# Altium schematic sheet gateway.SchDoc
size A3
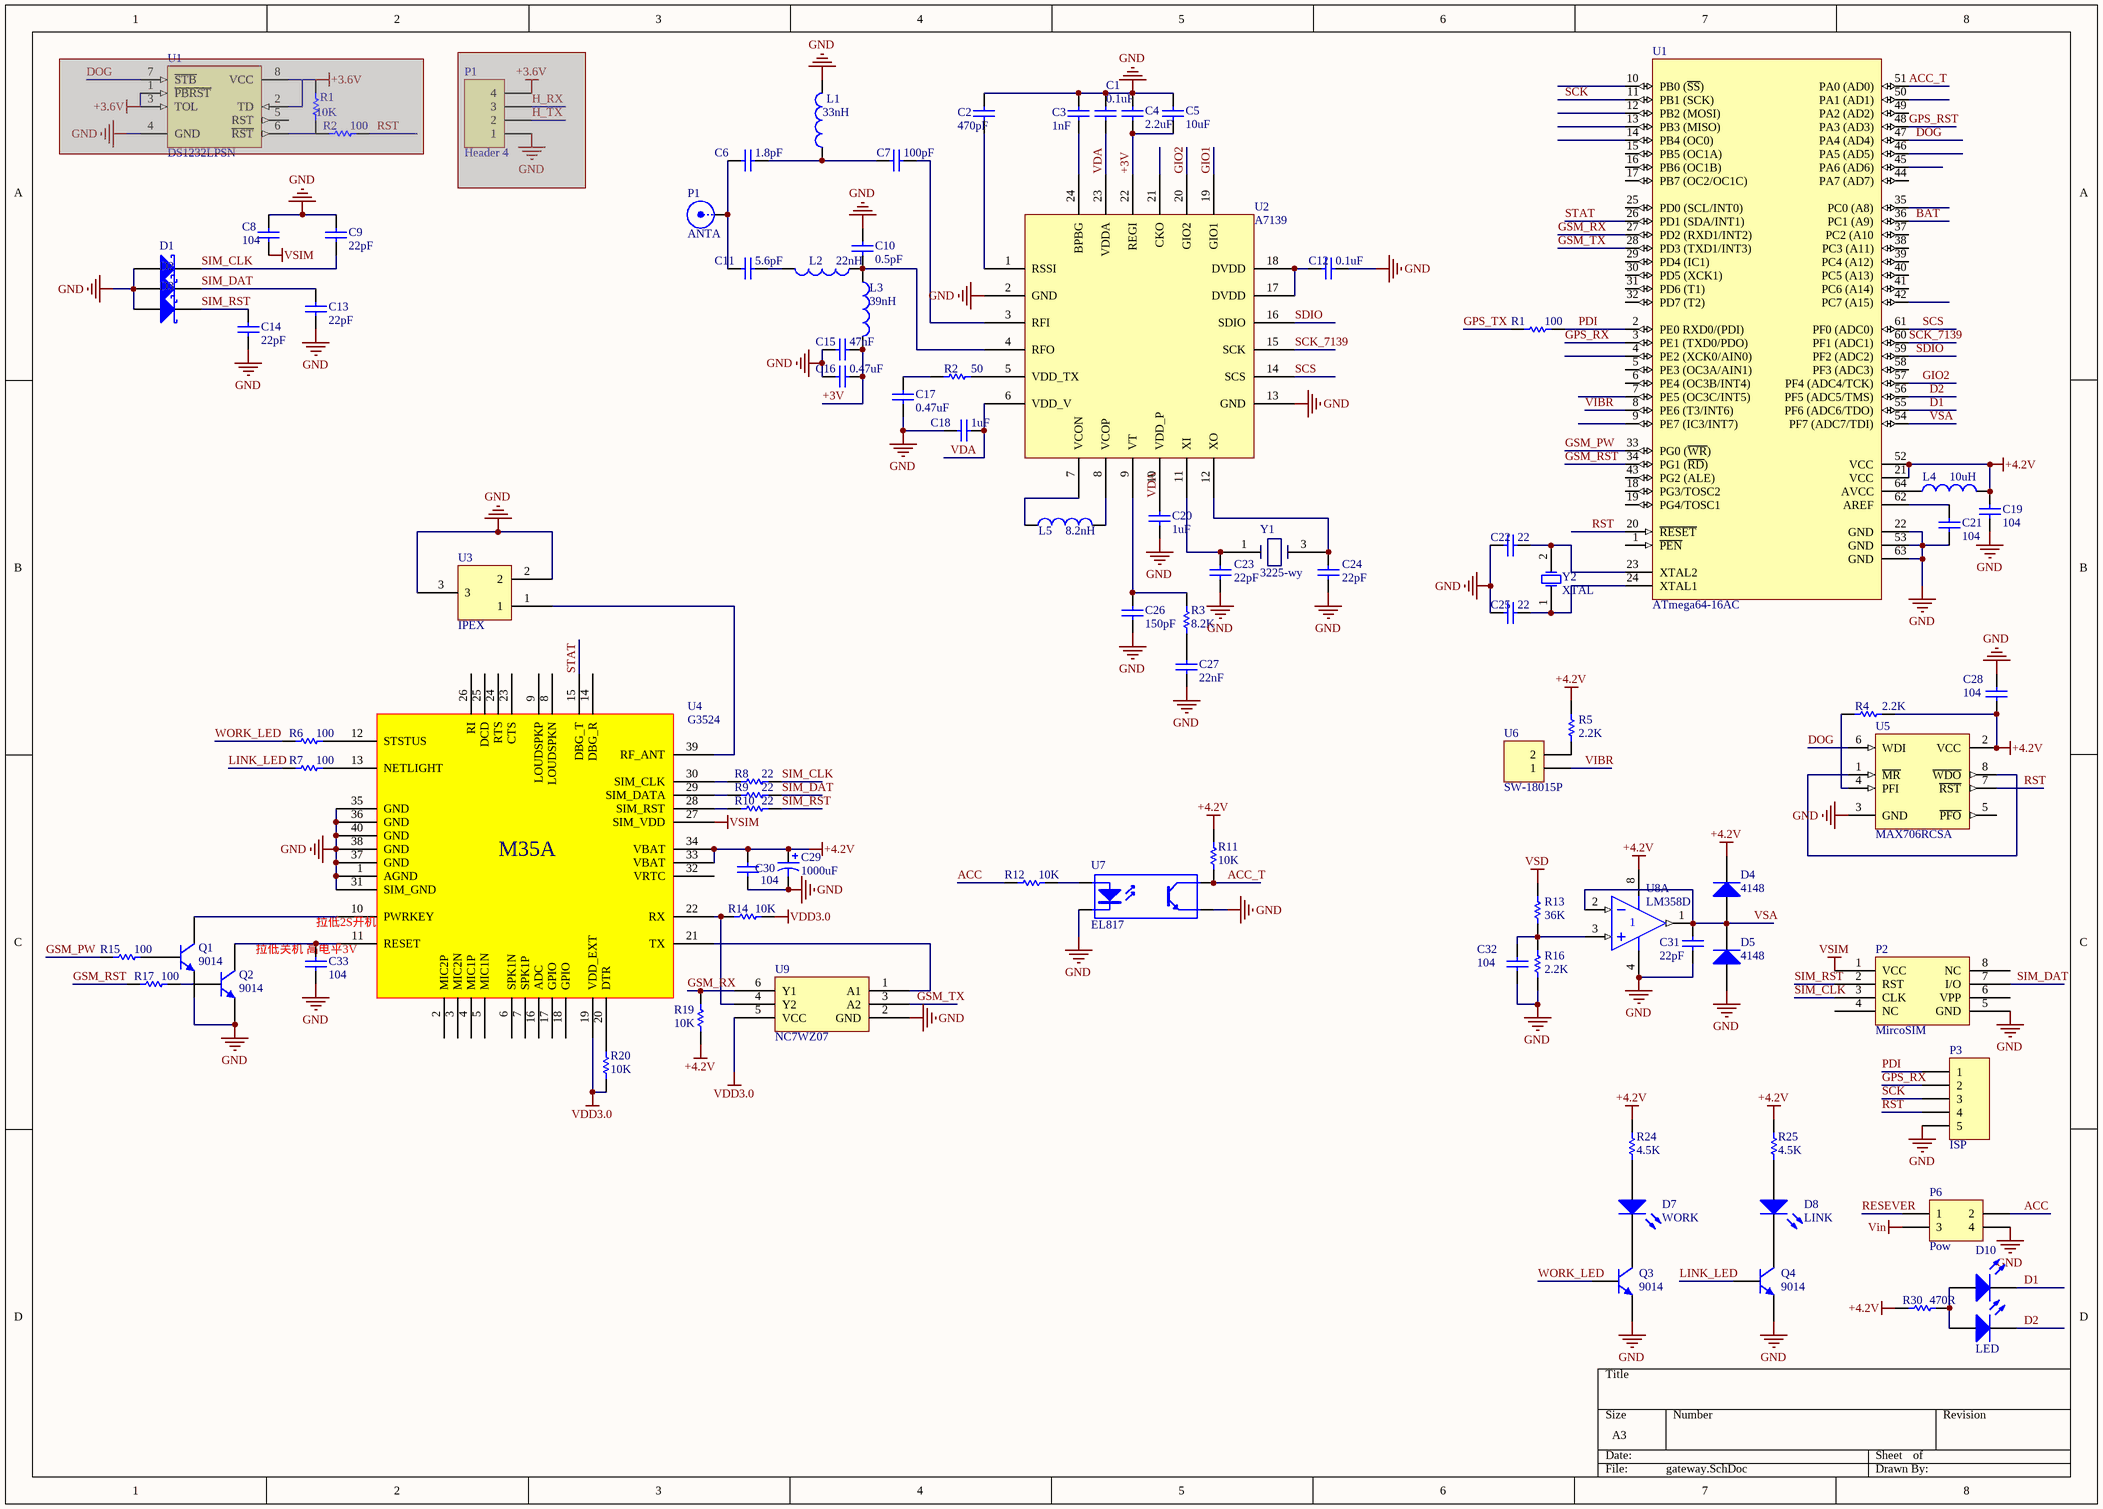
[diagram p0: gateway.SchDoc]

## Parts
(Parts that share a designator on the sheet are numbered #1, #2 ... from top to bottom, then left to right.)
C1  value 0.1uF  [0402-A]  (hidden comment: Cap)
C2  value 470pF  [0402-A]  (hidden comment: Cap)
C3  value 1nF  [0402-A]  (hidden comment: Cap)
C4  value 2.2uF  [0603]  (hidden comment: Cap)
C5  value 10uF  [0603]  (hidden comment: Cap)
C6  value 1.8pF  [0402-A]  (hidden comment: Cap)
C7  value 100pF  [0402-A]  (hidden comment: Cap)
C8  value 104  [0603]  (hidden comment: Cap)
C9  value 22pF  [0603]  (hidden comment: Cap)
C10  value 0.5pF  [0402-A]  (hidden comment: Cap)
C11  value 5.6pF  [0402-A]  (hidden comment: Cap)
C12  value 0.1uF  [0402-A]  (hidden comment: Cap)
C13  value 22pF  [0603]  (hidden comment: Cap)
C14  value 22pF  [0603]  (hidden comment: Cap)
C15  value 47nF  [0402-A]  (hidden comment: Cap)
C16  value 0.47uF  [0402-A]  (hidden comment: Cap)
C17  value 0.47uF  [0402-A]  (hidden comment: Cap)
C18  value 1uF  [0402-A]  (hidden comment: Cap)
C19  value 104  [0603]  (hidden comment: Cap)
C20  value 1uF  [0402-A]  (hidden comment: Cap)
C21  value 104  [0603]  (hidden comment: Cap)
C22  value 22  [0603]  (hidden comment: Cap)
C23  value 22pF  [0402-A]  (hidden comment: Cap)
C24  value 22pF  [0402-A]  (hidden comment: Cap)
C25  value 22  [0603]  (hidden comment: Cap)
C26  value 150pF  [0402-A]  (hidden comment: Cap)
C27  value 22nF  [0402-A]  (hidden comment: Cap)
C28  value 104  [0603]  (hidden comment: Cap)
C29  value 1000uF  [C8x10-SMD]  (hidden comment: Cap Pol3)
C30  value 104  [0603]  (hidden comment: Cap)
C31  value 22pF  [0603]  (hidden comment: Cap)
C32  value 104  [0603]  (hidden comment: Cap)
C33  value 104  [0603]  (hidden comment: Cap)
D1  RL0603E012M100K  [0603]  (value not drawn)
D2  RL0603E012M100K  [0603]  (value not drawn)
D3  RL0603E012M100K  [0603]  (value not drawn)
D4  4148  [LL34]
D5  4148  [LL34]
D7  WORK  [0603-LED]
D8  LINK  [0603-LED]
D10  LED  [DIP-3]
L1  value 33nH  [0603]  (hidden comment: Inductor)
L2  value 22nH  [0603]  (hidden comment: Inductor)
L3  value 39nH  [0603]  (hidden comment: Inductor)
L4  value 10uH  [0603]  (hidden comment: Inductor)
L5  value 8.2nH  [0402-A]  (hidden comment: Inductor)
P1#1  Header 4  [HDR1X4]  (masked out: inside a compile mask, not in the netlist)
P1#2  ANTA  [SMB_V-RJ45]
P2  MircoSIM  [Micro SIM]
P3  ISP  [HDR1X5]
P6  Pow  [5569]
Q1  value 9014  [SOT-23-NPN]  (hidden comment: NPN)
Q2  value 9014  [SOT-23-NPN]  (hidden comment: NPN)
Q3  value 9014  [SOT-23-NPN]  (hidden comment: NPN)
Q4  value 9014  [SOT-23-NPN]  (hidden comment: NPN)
R1#1  value 10K  [0603]  (hidden comment: Res1)  (masked out: inside a compile mask, not in the netlist)
R1#2  value 100  [0603]  (hidden comment: Res1)
R2#1  value 100  [0603]  (hidden comment: Res1)  (masked out: inside a compile mask, not in the netlist)
R2#2  value 50  [0402-A]  (hidden comment: Res1)
R3  value 8.2K  [0402-A]  (hidden comment: Res1)
R4  value 2.2K  [0603]  (hidden comment: Res1)
R5  value 2.2K  [0603]  (hidden comment: Res1)
R6  value 100  [0603]  (hidden comment: Res1)
R7  value 100  [0603]  (hidden comment: Res1)
R8  value 22  [0603]  (hidden comment: Res1)
R9  value 22  [0603]  (hidden comment: Res1)
R10  value 22  [0603]  (hidden comment: Res1)
R11  value 10K  [0603]  (hidden comment: Res1)
R12  value 10K  [0603]  (hidden comment: Res1)
R13  value 36K  [0603]  (hidden comment: Res1)
R14  value 10K  [0603]  (hidden comment: Res1)
R15  value 100  [0603]  (hidden comment: Res1)
R16  value 2.2K  [0603]  (hidden comment: Res1)
R17  value 100  [0603]  (hidden comment: Res1)
R19  value 10K  [0603]  (hidden comment: Res1)
R20  value 10K  [0603]  (hidden comment: Res1)
R24  value 4.5K  [0603]  (hidden comment: Res1)
R25  value 4.5K  [0603]  (hidden comment: Res1)
R30  value 470R  [0603]  (hidden comment: Res1)
U1#1  ATmega64-16AC  [64A_M]
U1#2  value DS1232LPSN  [SOIC8]  (hidden comment: DS1232)  (masked out: inside a compile mask, not in the netlist)
U2  A7139  [QFN24N]
U3  IPEX  [IPEX]
U4  G3524  [G3524]
U5  MAX706RCSA  [SOIC8]
U6  SW-18015P  [SW-18015]
U7  EL817  [PCBComponent_1]
U8  LM358D  [SOIC8]  (part A of 2)
U9  NC7WZ07  [SC70-6]
Y1  3225-wy
Y2  XTAL  [49SD]

## Nets
+4.2V: C19.1 C28.2 C29.1 C30.2 D4.2(K) L4.2 R4.2 R5.2 R11.2 R19.2 R24.1 R25.1 R30.2 U1#1.21(VCC) U1#1.52(VCC) U4.33(VBAT) U4.34(VBAT) U5.2(VCC) U8.8(V+)
GND: C1.2 C2.2 C3.2 C4.2 C5.2 C8.1 C9.1 C10.2 C12.2 C13.2 C14.2 C15.1 C16.1 C17.1 C18.2 C19.2 C20.1 C21.2 C22.2 C23.1 C24.1 C25.2 C26.1 C27.2 C28.1 C29.2 C30.1 C31.1 C32.2 C33.2 D1.2(A) D2.2(A) D3.2(A) D5.1(A) L1.2 P1#2.2(Y) P2.5(GND) P3.5 P6.4 Q1.1(E) Q2.1(E) Q3.1(E) Q4.1(E) R16.1 U1#1.22(GND) U1#1.53(GND) U1#1.63(GND) U2.2(GND) U2.13(GND) U2.25(GND) U3.2 U3.3 U4.1(AGND) U4.31(SIM_GND) U4.35(GND) U4.36(GND) U4.37(GND) U4.38(GND) U4.40(GND) U5.3(GND) U7.2(K) U7.3(E) U8.4(V-) U9.2(GND)
VDD3.0: R14.1 R20.2 U4.19(VDD_EXT) U9.5(VCC)
Vin: P6.3
VSD: R13.2
VSIM: C8.2 P2.1(VCC) U4.27(SIM_VDD)
+3V: C4.1 C5.1 C15.2 C16.2 L3.2 U2.22(REGI)
ACC: P6.2 R12.1
ACC_T: R11.1 U1#1.51(PA0_(AD0)) U7.4(C)
BAT: U1#1.36(PC1_(A9))
D1: D10.1(K) U1#1.55(PF6_(ADC6/TDO))
D2: D10.3(K) U1#1.56(PF5_(ADC5/TMS))
DOG: U1#1.47(PA4_(AD4)) U5.6(WDI)
GIO1: U2.19(GIO1)
GIO2: U1#1.57(PF4_(ADC4/TCK)) U2.20(GIO2)
GPS_RST: U1#1.48(PA3_(AD3))
GPS_RX: P3.2 U1#1.3(PE1_(TXD0/PDO))
GPS_TX: R1#2.1
GSM_PW: R15.2 U1#1.33(PG0_(~{WR}))
GSM_RST: R17.2 U1#1.34(PG1_(~{RD}))
GSM_RX: R19.1 U1#1.27(PD2_(RXD1/INT2)) U9.6(Y1)
GSM_TX: U1#1.28(PD3_(TXD1/INT3)) U9.3(A2)
LINK_LED: Q4.2(B) R7.2
PDI: P3.1 R1#2.2 U1#1.2(PE0_RXD0/(PDI))
RESEVER: P6.1
RST: P3.4 U1#1.20(~{RESET}) U5.7(~{RST})
SCK: P3.3 U1#1.11(PB1_(SCK))
SCK_7139: U1#1.60(PF1_(ADC1)) U2.15(SCK)
SCS: U1#1.61(PF0_(ADC0)) U2.14(SCS)
SDIO: U1#1.59(PF2_(ADC2)) U2.16(SDIO)
SIM_CLK: C9.2 D1.1(K) P2.3(CLK) R8.1
SIM_DAT: C13.1 D2.1(K) P2.7(I/O) R9.1
SIM_RST: C14.1 D3.1(K) P2.2(RST) R10.1
STAT: U1#1.26(PD1_(SDA/INT1)) U4.15(DBG_T)
VDA: C1.1 C18.1 C20.2 U2.6(VDD_V) U2.10(VDD_P) U2.23(VDDA)
VIBR: U1#1.8(PE6_(T3/INT6)) U6.1
VSA: C31.2 D4.1(A) D5.2(K) U1#1.54(PF7_(ADC7/TDI)) U8.1(OUT) U8.2(IN-)
WORK_LED: Q3.2(B) R6.2
NetC2_1: C2.1 U2.1(RSSI)
NetC3_1: C3.1 U2.24(BPBG)
NetC6_1: C6.1 C7.2 L1.1
NetC6_2: C6.2 C11.2 P1#2.1(X)
NetC7_1: C7.1 U2.3(RFI)
NetC10_1: C10.1 L2.1 L3.1 U2.4(RFO)
NetC11_1: C11.1 L2.2
NetC12_1: C12.1 U2.17(DVDD) U2.18(DVDD)
NetC17_2: C17.2 R2#2.2
NetC21_1: C21.1 U1#1.62(AREF)
NetC22_1: C22.1 U1#1.23(XTAL2) Y2.2(OSC2)
NetC23_2: C23.2 U2.11(XI) Y1.1
NetC24_2: C24.2 U2.12(XO) Y1.3
NetC25_1: C25.1 U1#1.24(XTAL1) Y2.1(OSC1)
NetC26_2: C26.2 R3.2 U2.9(VT)
NetC27_1: C27.1 R3.1
NetC32_1: C32.1 R13.1 R16.2 U8.3(IN+)
NetC33_1: C33.1 Q2.3(C) U4.11(RESET)
NetD7_1: D7.1(A) R24.2
NetD7_2: D7.2(K) Q3.3(C)
NetD8_1: D8.1(A) R25.2
NetD8_2: D8.2(K) Q4.3(C)
NetD10_2: D10.2(A) R30.1
NetL4_1: L4.1 U1#1.64(AVCC)
NetL5_1: L5.1 U2.7(VCON)
NetL5_2: L5.2 U2.8(VCOP)
NetQ1_2: Q1.2(B) R15.1
NetQ1_3: Q1.3(C) U4.10(PWRKEY)
NetQ2_2: Q2.2(B) R17.1
NetR2#2_1: R2#2.1 U2.5(VDD_TX)
NetR4_1: R4.1 U5.4(PFI)
NetR5_1: R5.1 U6.2
NetR6_1: R6.1 U4.12(STSTUS)
NetR7_1: R7.1 U4.13(NETLIGHT)
NetR8_2: R8.2 U4.30(SIM_CLK)
NetR9_2: R9.2 U4.29(SIM_DATA)
NetR10_2: R10.2 U4.28(SIM_RST)
NetR12_2: R12.2 U7.1(A)
NetR14_2: R14.2 U4.22(RX) U9.4(Y2)
NetR20_1: R20.1 U4.20(DTR)
NetU3_1: U3.1 U4.39(RF_ANT)
NetU4_21: U4.21(TX) U9.1(A1)
NetU5_1: U5.1(~{MR}) U5.8(~{WDO})

Not connected (* = marked no-connect by the designer): P2 4(NC) 6(VPP) 8(NC); U1#1 1(~{PEN}) 4(PE2_(XCK0/AIN0)) 5(PE3_(OC3A/AIN1)) 6(PE4_(OC3B/INT4)) 7(PE5_(OC3C/INT5)) 9(PE7_(IC3/INT7)) 10(PB0_(~{SS})) 12(PB2_(MOSI)) 13(PB3_(MISO)) 14(PB4_(OC0)) 15(PB5_(OC1A)) 16(PB6_(OC1B)) 17(PB7_(OC2/OC1C)) 18(PG3/TOSC2) 19(PG4/TOSC1) 25(PD0_(SCL/INT0)) 29(PD4_(IC1)) 30(PD5_(XCK1)) 31(PD6_(T1)) 32(PD7_(T2)) 35(PC0_(A8)) 37(PC2_(A10) 38(PC3_(A11)) 39(PC4_(A12)) 40(PC5_(A13)) 41(PC6_(A14)) 42(PC7_(A15)) 43(PG2_(ALE)) 44(PA7_(AD7)) 45(PA6_(AD6)) 46(PA5_(AD5)) 49(PA2_(AD2)) 50(PA1_(AD1)) 58(PF3_(ADC3)); U2 21(CKO); U4 2(MIC2P) 3(MIC2N) 4(MIC1P) 5(MIC1N) 6(SPK1N) 7(SPK1P) 8(LOUDSPKN) 9(LOUDSPKP) 14(DBG_R) 16(ADC) 17(GPIO) 18(GPIO) 23(CTS) 24(RTS) 25(DCD) 26(RI) 32(VRTC); U5 5(~{PFO})

## Notes on the sheet
- (near C33) 拉低关机 高电平3V
- 拉低2S开机
- (in symbol G3524) M35A

## Library data of the parts
C1-C28 C30-C33 = Cap: Capacitor; Published: 8-Jun-2000; LatestRevisionDate: 17-Jul-2002; LatestRevisionNote: Re-released for DXP Platform.; PackageReference: RAD-0.3; Publisher: Altium Limited
C29 = Cap Pol3: Polarized Capacitor (Surface Mount); Published: 8-Jun-2000; LatestRevisionDate: 17-Jul-2002; LatestRevisionNote: Re-released for DXP Platform.; PackageReference: C0805; Publisher: Altium Limited
D1-D3 = Diode 18TQ045: Schottky Rectifier; Note: Terminal 2 is the TAB and is electrically connected to the cathode; Value: SMBJ45CA; Published: 8-Jun-2000; LatestRevisionDate: 17-Jul-2002; LatestRevisionNote: Re-released for DXP Platform.; DatasheetDocument: Dec-1997; PackageDocument: Feb-1998; PackageReference: TO-220AC; Publisher: Altium Limited; ComponentLink1Description: Manufacturer Link; ComponentLink1URL: http://www.irf.com/; ComponentLink2Description: Datasheet; ComponentLink2URL: http://www.irf.com/product-info/datasheets/data/18tq.pdf
D4 D5 = Diode 1N5408: 3 Amp Medium Power Silicon Rectifier Diode; Value: 1N4148; Published: 8-Jun-2000; LatestRevisionDate: 17-Jul-2002; LatestRevisionNote: Re-released for DXP Platform.; DatasheetDocument: Aug-1984; PackageReference: DO-201AD; Publisher: Altium Limited; ComponentLink1Description: Manufacturer Link; ComponentLink1URL: http://www.irf.com/
D7 D8 = LED2: Typical RED, GREEN, YELLOW, AMBER GaAs LED; Value: GRN; Published: 8-Jun-2000; LatestRevisionDate: 17-Jul-2002; LatestRevisionNote: Re-released for DXP Platform.; PackageDocument: Feb-2002; PackageReference: 3.2X1.6X1.1; Publisher: Altium Limited
D10 = LED-DOUBLE: Value: LED
L1-L5 = Inductor: Code_IEC: 1005; Published: 8-Jun-2000; LatestRevisionDate: 17-Jul-2002; LatestRevisionNote: Re-released for DXP Platform.; PackageReference: 0402-A; Publisher: Altium Limited; Code_JEITA: 0402
P1#1 = Header 4: Header, 4-Pin; LatestRevisionDate: 17-Jul-2002; LatestRevisionNote: Re-released for DXP Platform.; Publisher: Altium Limited
P1#2 = SMB: SMB Straight Connector; LatestRevisionDate: 17-Jul-2002; LatestRevisionNote: Re-released for DXP Platform.; Publisher: Altium Limited
P3 = Header 5: Header, 5-Pin; LatestRevisionDate: 17-Jul-2002; LatestRevisionNote: Re-released for DXP Platform.; Publisher: Altium Limited
P6 = Header 2X2: Header, 2-Pin, Dual row; LatestRevisionDate: 17-Jul-2002; LatestRevisionNote: Re-released for DXP Platform.; Publisher: Altium Limited
Q1-Q4 = 2N5551: NPN General Purpose Amplifier; Published: 8-Jun-2000; LatestRevisionDate: 17-Jan-2003; LatestRevisionNote: PCB Footprint 'BCY-W3/D4.7' replaced; DatasheetDocument: 1997; PackageDocument: Sep-1998; PackageReference: TO-92A; Publisher: Altium Limited; ComponentLink1Description: Manufacturer Link; ComponentLink1URL: http://www.fairchildsemi.com/; ComponentLink2Description: Datasheet; ComponentLink2URL: http://www.fairchildsemi.com/ds/2N%2F2N5551.pdf
R1#1 R1#2 R2#1 R2#2 R3-R17 R19 R20 R24 R25 R30 = Res1: Resistor; Published: 8-Jun-2000; LatestRevisionDate: 17-Jul-2002; LatestRevisionNote: Re-released for DXP Platform.; PackageReference: AXIAL-0.3; Publisher: Altium Limited
U1#1 = ATmega64-16AC: 8-Bit AVR Microcontroller with 64K Bytes of In-System Programmable Flash Memory; Published: 17-Sep-2003; LatestRevisionDate: 13-Apr-2006; LatestRevisionNote: IPC-7351 Footprint Added.; DatasheetVersion: 2490C-AVR-009/02; PackageVersion: revB, Oct-2001; PackageReference: 64A; Publisher: Altium Limited; PackageDescription: 64-Pin Thin Quad Flat Pack 0.8 mm Pitch; Code_JEDEC: MS-026-AEB; ComponentLink1Description: Manufacturer Link; ComponentLink1URL: http://www.atmel.com; ComponentLink2Description: Datasheet; ComponentLink2URL: http://www.atmel.com/dyn/resources/prod_documents/doc2490.pdf
U1#2 = DS1232LPSN-2: Low-Power MicroMonitor Chip; Published: 13-Oct-2000; LatestRevisionDate: 13-Apr-2006; LatestRevisionNote: IPC-7351 Footprint Added.; DatasheetVersion: 26-Jun-1998; PackageVersion: 1999; PackageReference: SOIC8N; Publisher: Altium Limited; PackageDescription: 8-Pin Small Outline Integrated Circuit 1.27 mm Pitch; Code_IPC: SOIC127P600-8; ComponentLink1Description: Manufacturer Link; ComponentLink1URL: http://www.maxim-ic.com/; ComponentLink2Description: Datasheet; ComponentLink2URL: http://pdfserv.maxim-ic.com/en/ds/DS1232LP.pdf
U5 = MAX706RCSA: +3V Voltage Monitoring, Low-Cost, 礟 Supervisory Circuit; Published: 16-Jan-2001; LatestRevisionDate: 13-Apr-2006; LatestRevisionNote: IPC-7351 Footprint Added.; DatasheetVersion: Sep-1995; PackageReference: NSO8; Publisher: Altium Limited; PackageDescription: 8-Pin Small Outline Integrated Circuit 1.27 mm Pitch; Code_JEDEC: MS-012-AA; Code_IPC: SOIC127P600-8; ComponentLink1Description: Manufacturer Link; ComponentLink1URL: http://www.maxim-ic.com/; ComponentLink2Description: Datasheet; ComponentLink2URL: http://pdfserv.maxim-ic.com/en/ds/MAX706P-MAX708T.pdf
U6 = Header 2: Header, 2-Pin; LatestRevisionDate: 17-Jul-2002; LatestRevisionNote: Re-released for DXP Platform.; Publisher: Altium Limited
U7 = Optoisolator1: 4-Pin Phototransistor Optocoupler; Published: 24-Mar-1999; LatestRevisionDate: 04-Mar-2005; LatestRevisionNote: Sch pins 3 & 4 Swapped.; DatasheetDocument: Nov-2003; PackageReference: DIP-4; Publisher: Altium Limited
U8 = LM358D: Dual Low-Power Operational Amplifier; Published: 17-Jul-2002; LatestRevisionDate: 13-Apr-2006; LatestRevisionNote: IPC-7351 Footprint Added.; DatasheetVersion: 1988; PackageReference: 751-02; Publisher: Altium Limited; PackageDescription: 8-Pin Small Outline Integrated Circuit 1.27 mm Pitch; Code_JEDEC: MS-012-AA; Code_IPC: SOIC127P600-8; ComponentLink1Description: Manufacturer Link; ComponentLink1URL: http://www.onsemi.com/site/products/parametrics/0,4446,251,00.html; ComponentLink2Description: Datasheet; ComponentLink2URL: http://www.onsemi.com/pub/Collateral/LM358-D.PDF
Y2 = XTAL: Crystal Oscillator; Published: 8-Jun-2000; LatestRevisionDate: 17-Jul-2002; LatestRevisionNote: Re-released for DXP Platform.; PackageReference: R38; Publisher: Altium Limited